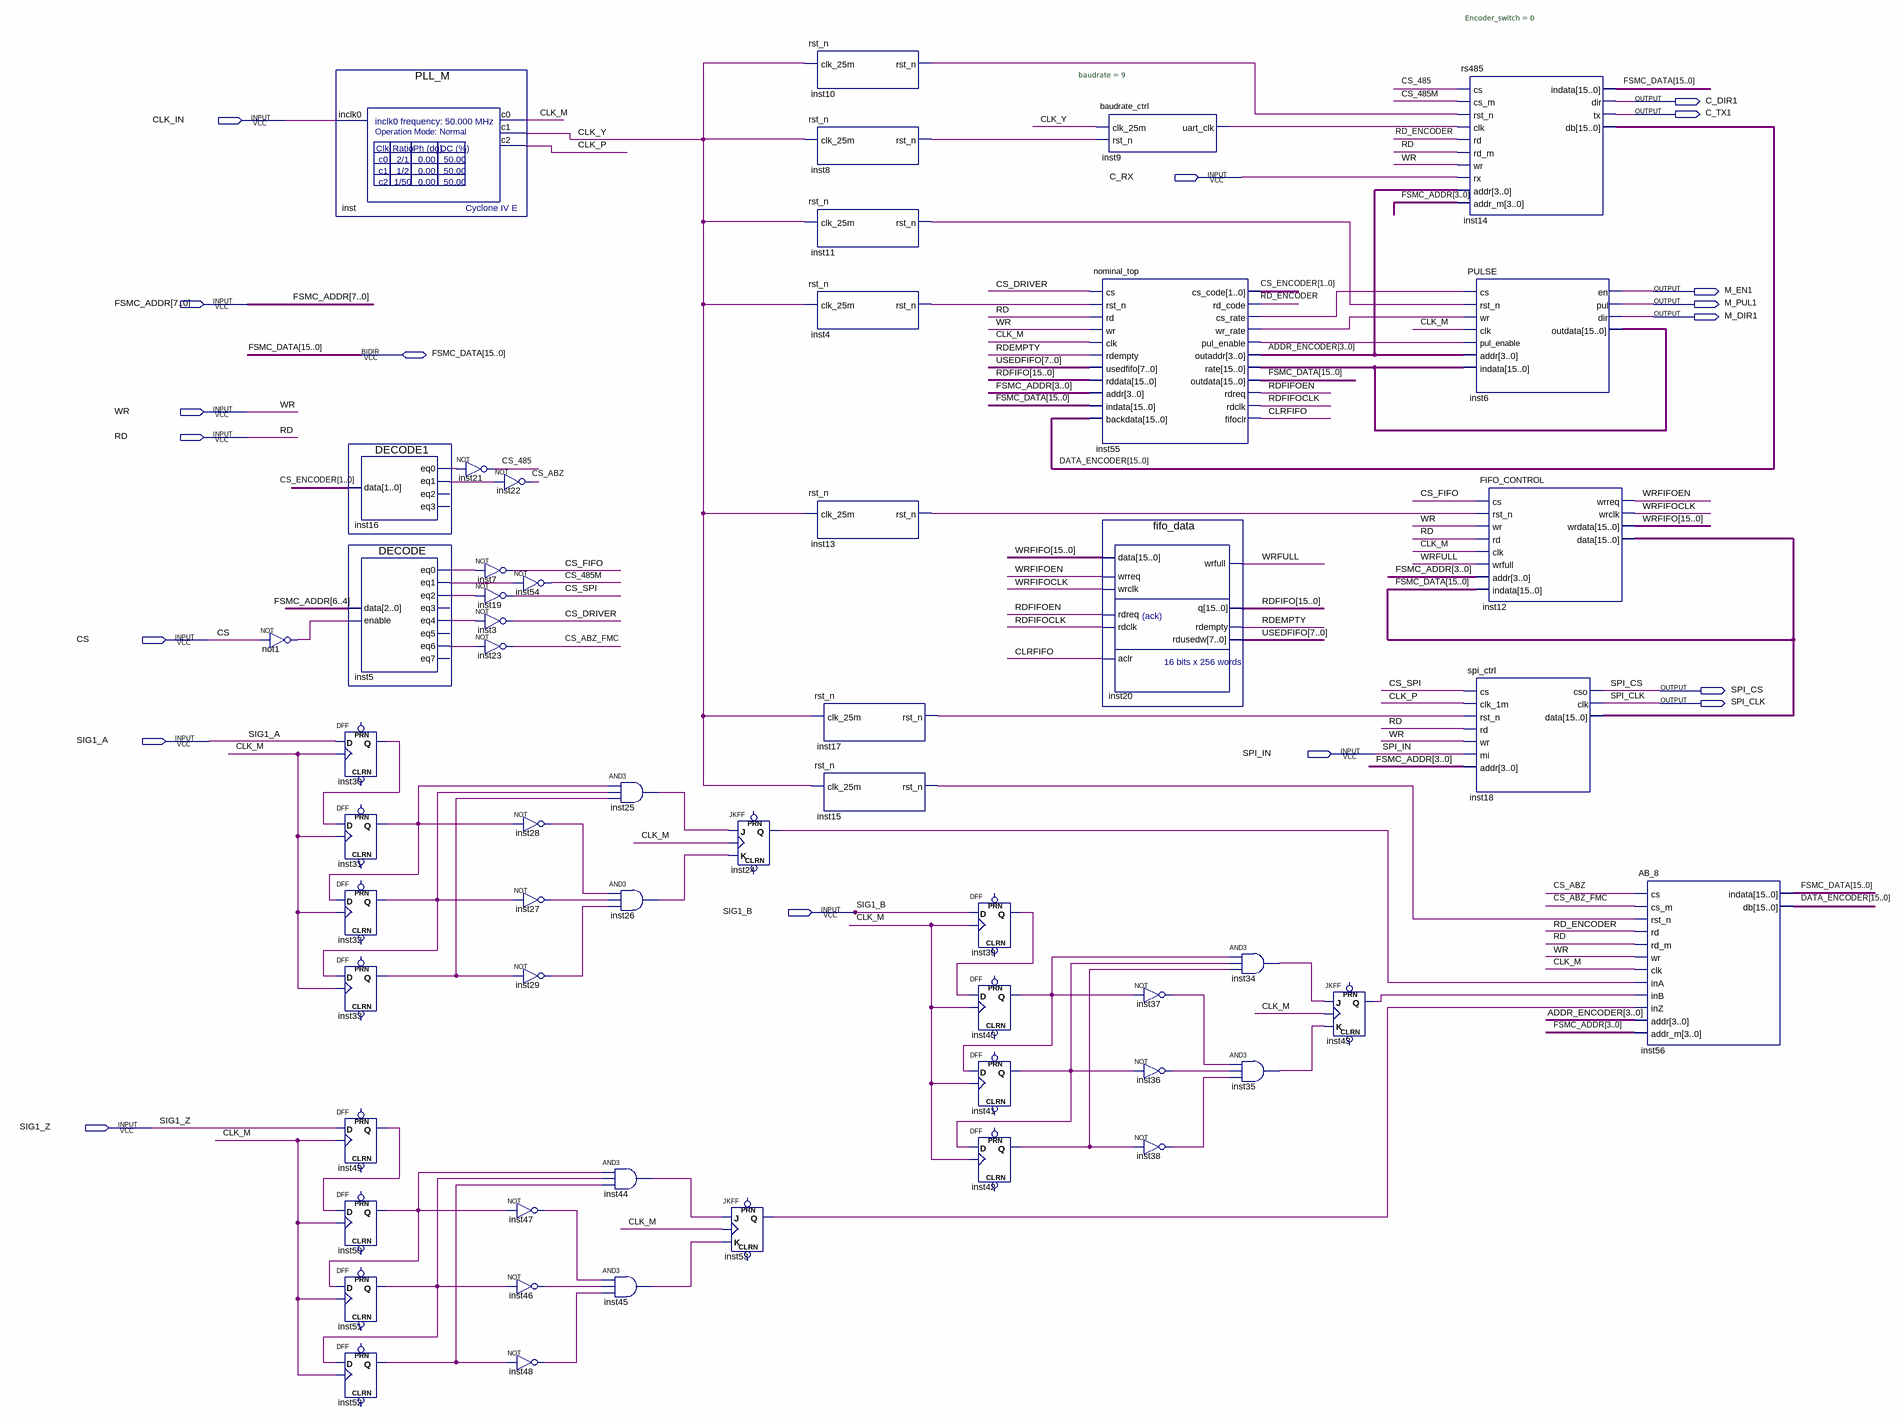
[diagram p0: schematic sheet]
// Quartus schematic SEA.bdf as structural Verilog: 56 symbols, 18 pins
module SEA (
  input  CLK_IN,
  input  C_RX,
  input  [7:0] FSMC_ADDR,
  input  WR,
  input  RD,
  input  CS,
  input  SIG1_A,
  input  SPI_IN,
  input  SIG1_B,
  input  SIG1_Z,
  inout  [15:0] FSMC_DATA,
  output C_DIR1,
  output C_TX1,
  output M_EN1,
  output M_PUL1,
  output M_DIR1,
  output SPI_CS,
  output SPI_CLK
);

  wire CLK_M, CLK_P, CLK_Y, CLRFIFO, CS_485, CS_485M, CS_ABZ, CS_ABZ_FMC, CS_DRIVER, CS_FIFO, CS_SPI,
       inst4_rst_n, inst5_eq0, inst5_eq1, inst5_eq2, inst5_eq4, inst5_eq6, inst8_rst_n, inst9_uart_clk,
       inst10_rst_n, inst11_rst_n, inst13_rst_n, inst15_rst_n, inst16_eq0, inst16_eq1, inst17_rst_n,
       inst24_q, inst25_out, inst26_out, inst27_out, inst28_out, inst29_out, inst30_q, inst31_q, inst32_q,
       inst33_q, inst34_out, inst35_out, inst36_out, inst37_out, inst38_out, inst39_q, inst40_q, inst41_q,
       inst42_q, inst43_q, inst44_out, inst45_out, inst46_out, inst47_out, inst48_out, inst49_q, inst50_q,
       inst51_q, inst52_q, inst53_q, inst55_cs_rate, inst55_pul_enable, inst55_wr_rate, not1_out, RD_ENCODER,
       RDEMPTY, RDFIFOCLK, RDFIFOEN, WRFIFOCLK, WRFIFOEN, WRFULL;
  wire [1:0] CS_ENCODER;
  wire [3:0] ADDR_ENCODER;
  wire [7:0] USEDFIFO;
  wire [15:0] DATA_ENCODER, inst55_rate, RDFIFO, WRFIFO;

  not not1 (not1_out, CS);
  PLL_M inst (.inclk0(CLK_IN), .c0(CLK_M), .c1(CLK_Y), .c2(CLK_P));
  DECODE1 inst16 (.data(CS_ENCODER), .eq0(inst16_eq0), .eq1(inst16_eq1));  // open: eq2, eq3
  DECODE inst5 (
    .data(FSMC_ADDR[6:4]), .enable(not1_out), .eq0(inst5_eq0), .eq1(inst5_eq1), .eq2(inst5_eq2),
    .eq4(inst5_eq4), .eq6(inst5_eq6));  // open: eq3, eq5, eq7
  DFF inst30 (.CLK(CLK_M), .D(SIG1_A), .Q(inst30_q));  // open: CLRN, PRN
  DFF inst31 (.CLK(CLK_M), .D(inst30_q), .Q(inst31_q));  // open: CLRN, PRN
  DFF inst32 (.CLK(CLK_M), .D(inst31_q), .Q(inst32_q));  // open: CLRN, PRN
  DFF inst33 (.CLK(CLK_M), .D(inst32_q), .Q(inst33_q));  // open: CLRN, PRN
  DFF inst49 (.CLK(CLK_M), .D(SIG1_Z), .Q(inst49_q));  // open: CLRN, PRN
  DFF inst50 (.CLK(CLK_M), .D(inst49_q), .Q(inst50_q));  // open: CLRN, PRN
  DFF inst51 (.CLK(CLK_M), .D(inst50_q), .Q(inst51_q));  // open: CLRN, PRN
  DFF inst52 (.CLK(CLK_M), .D(inst51_q), .Q(inst52_q));  // open: CLRN, PRN
  not inst21 (CS_485, inst16_eq0);
  not inst22 (CS_ABZ, inst16_eq1);
  not inst7 (CS_FIFO, inst5_eq0);
  not inst19 (CS_SPI, inst5_eq2);
  not inst3 (CS_DRIVER, inst5_eq4);
  not inst23 (CS_ABZ_FMC, inst5_eq6);
  not inst47 (inst47_out, inst50_q);
  not inst46 (inst46_out, inst51_q);
  not inst48 (inst48_out, inst52_q);
  not inst54 (CS_485M, inst5_eq1);
  not inst28 (inst28_out, inst31_q);
  not inst27 (inst27_out, inst32_q);
  not inst29 (inst29_out, inst33_q);
  and inst25 (inst25_out, inst31_q, inst32_q, inst33_q);
  and inst26 (inst26_out, inst28_out, inst27_out, inst29_out);
  and inst44 (inst44_out, inst50_q, inst51_q, inst52_q);
  and inst45 (inst45_out, inst47_out, inst46_out, inst48_out);
  JKFF inst24 (.K(inst26_out), .J(inst25_out), .CLK(CLK_M), .Q(inst24_q));  // open: PRN, CLRN
  JKFF inst53 (.K(inst45_out), .J(inst44_out), .CLK(CLK_M), .Q(inst53_q));  // open: PRN, CLRN
  rst_n inst10 (.clk_25m(CLK_Y), .rst_n(inst10_rst_n));
  rst_n inst8 (.clk_25m(CLK_Y), .rst_n(inst8_rst_n));
  rst_n inst11 (.clk_25m(CLK_Y), .rst_n(inst11_rst_n));
  rst_n inst4 (.clk_25m(CLK_Y), .rst_n(inst4_rst_n));
  rst_n inst13 (.clk_25m(CLK_Y), .rst_n(inst13_rst_n));
  rst_n inst17 (.clk_25m(CLK_Y), .rst_n(inst17_rst_n));
  rst_n inst15 (.clk_25m(CLK_Y), .rst_n(inst15_rst_n));
  DFF inst39 (.CLK(CLK_M), .D(SIG1_B), .Q(inst39_q));  // open: CLRN, PRN
  DFF inst40 (.CLK(CLK_M), .D(inst39_q), .Q(inst40_q));  // open: CLRN, PRN
  DFF inst41 (.CLK(CLK_M), .D(inst40_q), .Q(inst41_q));  // open: CLRN, PRN
  DFF inst42 (.CLK(CLK_M), .D(inst41_q), .Q(inst42_q));  // open: CLRN, PRN
  baudrate_ctrl #(.baudrate(9)) inst9 (.clk_25m(CLK_Y), .rst_n(inst8_rst_n), .uart_clk(inst9_uart_clk));
  nominal_top inst55 (
    .cs(CS_DRIVER), .rst_n(inst4_rst_n), .rd(RD), .wr(WR), .clk(CLK_M), .rdempty(RDEMPTY),
    .usedfifo(USEDFIFO), .rddata(RDFIFO), .addr(FSMC_ADDR[3:0]), .indata(FSMC_DATA), .backdata(DATA_ENCODER),
    .cs_code(CS_ENCODER), .rd_code(RD_ENCODER), .cs_rate(inst55_cs_rate), .wr_rate(inst55_wr_rate),
    .pul_enable(inst55_pul_enable), .outaddr(ADDR_ENCODER), .rate(inst55_rate), .outdata(FSMC_DATA),
    .rdreq(RDFIFOEN), .rdclk(RDFIFOCLK), .fifoclr(CLRFIFO));
  fifo_data inst20 (
    .data(WRFIFO), .wrreq(WRFIFOEN), .wrclk(WRFIFOCLK), .rdreq(RDFIFOEN), .rdclk(RDFIFOCLK), .aclr(CLRFIFO),
    .wrfull(WRFULL), .q(RDFIFO), .rdempty(RDEMPTY), .rdusedw(USEDFIFO));
  not inst37 (inst37_out, inst40_q);
  not inst36 (inst36_out, inst41_q);
  not inst38 (inst38_out, inst42_q);
  and inst34 (inst34_out, inst40_q, inst41_q, inst42_q);
  and inst35 (inst35_out, inst37_out, inst36_out, inst38_out);
  JKFF inst43 (.K(inst35_out), .J(inst34_out), .CLK(CLK_M), .Q(inst43_q));  // open: PRN, CLRN
  rs485 #(.Encoder_switch(0)) inst14 (
    .cs(CS_485), .cs_m(CS_485M), .rst_n(inst10_rst_n), .clk(inst9_uart_clk), .rd(RD_ENCODER), .rd_m(RD),
    .wr(WR), .rx(C_RX), .addr(ADDR_ENCODER), .addr_m(FSMC_ADDR[3:0]), .dir(C_DIR1), .tx(C_TX1),
    .db(DATA_ENCODER), .indata(FSMC_DATA));
  PULSE inst6 (
    .cs(inst55_cs_rate), .rst_n(inst11_rst_n), .wr(inst55_wr_rate), .clk(CLK_M),
    .pul_enable(inst55_pul_enable), .addr(ADDR_ENCODER), .indata(inst55_rate), .en(M_EN1), .pul(M_PUL1),
    .dir(M_DIR1), .outdata(inst55_rate));
  spi_ctrl inst18 (
    .cs(CS_SPI), .clk_1m(CLK_P), .rst_n(inst17_rst_n), .rd(RD), .wr(WR), .mi(SPI_IN), .addr(FSMC_ADDR[3:0]),
    .cso(SPI_CS), .clk(SPI_CLK), .data(FSMC_DATA));
  FIFO_CONTROL inst12 (
    .cs(CS_FIFO), .rst_n(inst13_rst_n), .wr(WR), .rd(RD), .clk(CLK_M), .wrfull(WRFULL),
    .addr(FSMC_ADDR[3:0]), .indata(FSMC_DATA), .wrreq(WRFIFOEN), .wrclk(WRFIFOCLK), .wrdata(WRFIFO),
    .data(FSMC_DATA));
  AB_8 inst56 (
    .cs(CS_ABZ), .cs_m(CS_ABZ_FMC), .rst_n(inst15_rst_n), .rd(RD_ENCODER), .rd_m(RD), .wr(WR), .clk(CLK_M),
    .inA(inst24_q), .inB(inst43_q), .inZ(inst53_q), .addr(ADDR_ENCODER), .addr_m(FSMC_ADDR[3:0]),
    .db(DATA_ENCODER), .indata(FSMC_DATA));
endmodule
